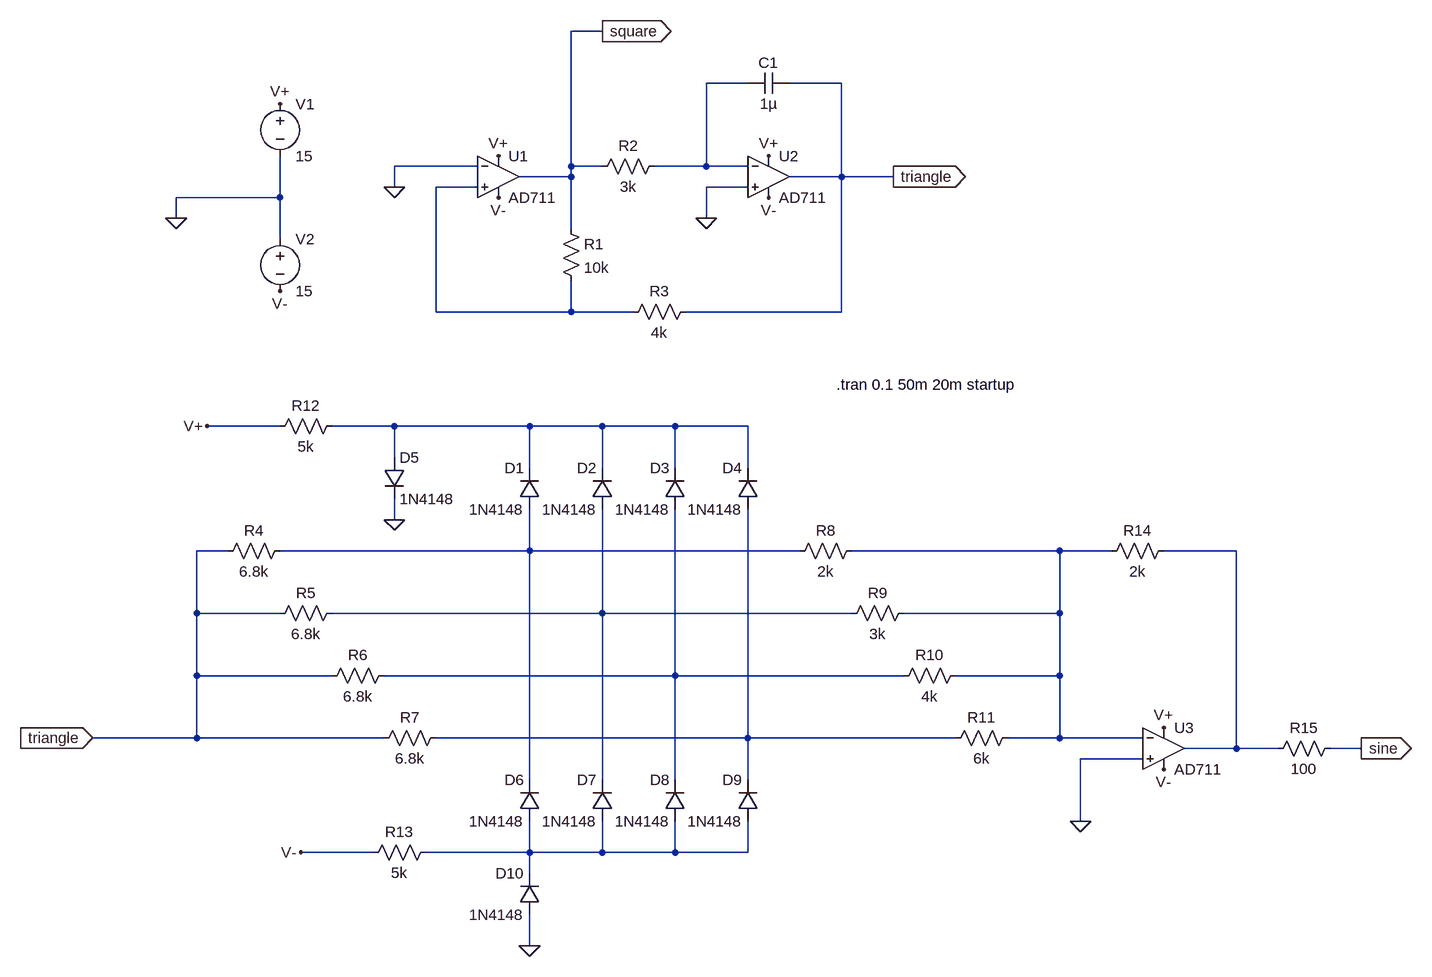
[diagram p0: schematic final project.asc]
final project.asc, the LTspice schematic file:
Version 4
SHEET 1 1864 1472
WIRE 608 48 560 48
WIRE 832 128 768 128
WIRE 976 128 896 128
WIRE 416 256 288 256
WIRE 560 256 560 48
WIRE 608 256 560 256
WIRE 768 256 768 128
WIRE 768 256 688 256
WIRE 832 256 768 256
WIRE 560 272 560 256
WIRE 560 272 480 272
WIRE 976 272 976 128
WIRE 976 272 896 272
WIRE 1056 272 976 272
WIRE 288 288 288 256
WIRE 416 288 352 288
WIRE 832 288 768 288
WIRE 112 304 112 240
WIRE 112 304 -48 304
WIRE -48 336 -48 304
WIRE 768 336 768 288
WIRE 560 352 560 272
WIRE 112 368 112 304
WIRE 352 480 352 288
WIRE 560 480 560 432
WIRE 560 480 352 480
WIRE 656 480 560 480
WIRE 976 480 976 272
WIRE 976 480 736 480
WIRE 112 656 0 656
WIRE 288 656 192 656
WIRE 496 656 288 656
WIRE 608 656 496 656
WIRE 720 656 608 656
WIRE 832 656 720 656
WIRE 288 704 288 656
WIRE 496 720 496 656
WIRE 608 720 608 656
WIRE 720 720 720 656
WIRE 832 720 832 656
WIRE 288 800 288 768
WIRE 32 848 -16 848
WIRE 496 848 496 784
WIRE 496 848 112 848
WIRE 912 848 496 848
WIRE 1312 848 992 848
WIRE 1392 848 1312 848
WIRE 1584 848 1472 848
WIRE -16 944 -16 848
WIRE 112 944 -16 944
WIRE 608 944 608 784
WIRE 608 944 192 944
WIRE 992 944 608 944
WIRE 1312 944 1312 848
WIRE 1312 944 1072 944
WIRE -16 1040 -16 944
WIRE 192 1040 -16 1040
WIRE 720 1040 720 784
WIRE 720 1040 272 1040
WIRE 1072 1040 720 1040
WIRE 1312 1040 1312 944
WIRE 1312 1040 1152 1040
WIRE -16 1136 -16 1040
WIRE -16 1136 -176 1136
WIRE 272 1136 -16 1136
WIRE 832 1136 832 784
WIRE 832 1136 352 1136
WIRE 1152 1136 832 1136
WIRE 1312 1136 1312 1040
WIRE 1312 1136 1232 1136
WIRE 1440 1136 1312 1136
WIRE 1584 1152 1584 848
WIRE 1584 1152 1504 1152
WIRE 1648 1152 1584 1152
WIRE 1776 1152 1728 1152
WIRE 1440 1168 1344 1168
WIRE 496 1200 496 848
WIRE 608 1200 608 944
WIRE 720 1200 720 1040
WIRE 832 1200 832 1136
WIRE 1344 1264 1344 1168
WIRE 256 1312 144 1312
WIRE 496 1312 496 1264
WIRE 496 1312 336 1312
WIRE 608 1312 608 1264
WIRE 608 1312 496 1312
WIRE 720 1312 720 1264
WIRE 720 1312 608 1312
WIRE 832 1312 832 1264
WIRE 832 1312 720 1312
WIRE 496 1344 496 1312
WIRE 496 1456 496 1408
FLAG -48 336 0
FLAG 112 448 V-
FLAG 112 160 V+
FLAG 288 288 0
FLAG 768 336 0
FLAG 448 240 V+
FLAG 864 240 V+
FLAG 448 304 V-
FLAG 864 304 V-
FLAG 608 48 square
IOPIN 608 48 Out
FLAG 1056 272 triangle
IOPIN 1056 272 Out
FLAG 288 800 0
FLAG 1344 1264 0
FLAG 1776 1152 sine
IOPIN 1776 1152 Out
FLAG 0 656 V+
FLAG 144 1312 V-
FLAG 496 1456 0
FLAG -176 1136 triangle
IOPIN -176 1136 In
FLAG 1472 1120 V+
FLAG 1472 1184 V-
SYMBOL voltage 112 144 R0
SYMATTR InstName V1
SYMATTR Value 15
SYMBOL voltage 112 352 R0
SYMATTR InstName V2
SYMATTR Value 15
SYMBOL OpAmps/AD711 448 208 R0
SYMATTR InstName U1
SYMBOL OpAmps/AD711 864 208 R0
SYMATTR InstName U2
SYMBOL Res 592 272 R270
WINDOW 0 32 56 VTop 2
WINDOW 3 0 56 VBottom 2
SYMATTR InstName R2
SYMATTR Value 3k
SYMBOL Res 544 336 R0
SYMATTR InstName R1
SYMATTR Value 10k
SYMBOL Res 752 464 R90
WINDOW 0 0 56 VBottom 2
WINDOW 3 32 56 VTop 2
SYMATTR InstName R3
SYMATTR Value 4k
SYMBOL cap 896 112 R90
WINDOW 0 0 32 VBottom 2
WINDOW 3 32 32 VTop 2
SYMATTR InstName C1
SYMATTR Value 1µ
SYMBOL Res 128 832 R90
WINDOW 0 0 56 VBottom 2
WINDOW 3 32 56 VTop 2
SYMATTR InstName R4
SYMATTR Value 6.8k
SYMBOL Res 208 928 R90
WINDOW 0 0 56 VBottom 2
WINDOW 3 32 56 VTop 2
SYMATTR InstName R5
SYMATTR Value 6.8k
SYMBOL Res 288 1024 R90
WINDOW 0 0 56 VBottom 2
WINDOW 3 32 56 VTop 2
SYMATTR InstName R6
SYMATTR Value 6.8k
SYMBOL Res 368 1120 R90
WINDOW 0 0 56 VBottom 2
WINDOW 3 32 56 VTop 2
SYMATTR InstName R7
SYMATTR Value 6.8k
SYMBOL Res 1008 832 R90
WINDOW 0 0 56 VBottom 2
WINDOW 3 32 56 VTop 2
SYMATTR InstName R8
SYMATTR Value 2k
SYMBOL Res 1088 928 R90
WINDOW 0 0 56 VBottom 2
WINDOW 3 32 56 VTop 2
SYMATTR InstName R9
SYMATTR Value 3k
SYMBOL Res 1168 1024 R90
WINDOW 0 0 56 VBottom 2
WINDOW 3 32 56 VTop 2
SYMATTR InstName R10
SYMATTR Value 4k
SYMBOL Res 1248 1120 R90
WINDOW 0 0 56 VBottom 2
WINDOW 3 32 56 VTop 2
SYMATTR InstName R11
SYMATTR Value 6k
SYMBOL diode 512 784 R180
WINDOW 0 24 64 Left 2
WINDOW 3 24 0 Left 2
SYMATTR InstName D1
SYMATTR Value 1N4148
SYMBOL diode 624 784 R180
WINDOW 0 24 64 Left 2
WINDOW 3 24 0 Left 2
SYMATTR InstName D2
SYMATTR Value 1N4148
SYMBOL diode 736 784 R180
WINDOW 0 24 64 Left 2
WINDOW 3 24 0 Left 2
SYMATTR InstName D3
SYMATTR Value 1N4148
SYMBOL diode 848 784 R180
WINDOW 0 24 64 Left 2
WINDOW 3 24 0 Left 2
SYMATTR InstName D4
SYMATTR Value 1N4148
SYMBOL diode 272 704 R0
SYMATTR InstName D5
SYMATTR Value 1N4148
SYMBOL diode 512 1264 R180
WINDOW 0 24 64 Left 2
WINDOW 3 24 0 Left 2
SYMATTR InstName D6
SYMATTR Value 1N4148
SYMBOL diode 624 1264 R180
WINDOW 0 24 64 Left 2
WINDOW 3 24 0 Left 2
SYMATTR InstName D7
SYMATTR Value 1N4148
SYMBOL diode 736 1264 R180
WINDOW 0 24 64 Left 2
WINDOW 3 24 0 Left 2
SYMATTR InstName D8
SYMATTR Value 1N4148
SYMBOL diode 848 1264 R180
WINDOW 0 24 64 Left 2
WINDOW 3 24 0 Left 2
SYMATTR InstName D9
SYMATTR Value 1N4148
SYMBOL diode 512 1408 R180
WINDOW 0 24 64 Left 2
WINDOW 3 24 0 Left 2
SYMATTR InstName D10
SYMATTR Value 1N4148
SYMBOL OpAmps/AD711 1472 1088 R0
SYMATTR InstName U3
SYMBOL Res 208 640 R90
WINDOW 0 0 56 VBottom 2
WINDOW 3 32 56 VTop 2
SYMATTR InstName R12
SYMATTR Value 5k
SYMBOL Res 352 1296 R90
WINDOW 0 0 56 VBottom 2
WINDOW 3 32 56 VTop 2
SYMATTR InstName R13
SYMATTR Value 5k
SYMBOL Res 1488 832 R90
WINDOW 0 0 56 VBottom 2
WINDOW 3 32 56 VTop 2
SYMATTR InstName R14
SYMATTR Value 2k
SYMBOL Res 1744 1136 R90
WINDOW 0 0 56 VBottom 2
WINDOW 3 32 56 VTop 2
SYMATTR InstName R15
SYMATTR Value 100
TEXT 968 592 Left 2 !.tran 0.1 50m 20m startup

The netlist it stands for:
* final project.asc
V1 V+ 0 15
V2 0 V- 15
XU1 N002 0 V+ V- square AD712  ; AD711, pins In+ In- V+ V- OUT
XU2 0 N001 V+ V- triangle AD712  ; AD711, pins In+ In- V+ V- OUT
R2 square N001 3k
R1 square N002 10k
R3 triangle N002 4k
C1 triangle N001 1µ
R4 N004 triangle 6.8k
R5 N007 triangle 6.8k
R6 N008 triangle 6.8k
R7 N009 triangle 6.8k
R8 N005 N004 2k
R9 N005 N007 3k
R10 N005 N008 4k
R11 N005 N009 6k
D1 N004 N003 1N4148
D2 N007 N003 1N4148
D3 N008 N003 1N4148
D4 N009 N003 1N4148
D5 N003 0 1N4148
D6 N010 N004 1N4148
D7 N010 N007 1N4148
D8 N010 N008 1N4148
D9 N010 N009 1N4148
D10 0 N010 1N4148
XU3 0 N005 V+ V- N006 AD712  ; AD711, pins In+ In- V+ V- OUT
R12 N003 V+ 5k
R13 N010 V- 5k
R14 N006 N005 2k
R15 sine N006 100
.model D D
.lib standard.dio
.tran 0.1 50m 20m startup
.lib ADI1.lib
.backanno
.end